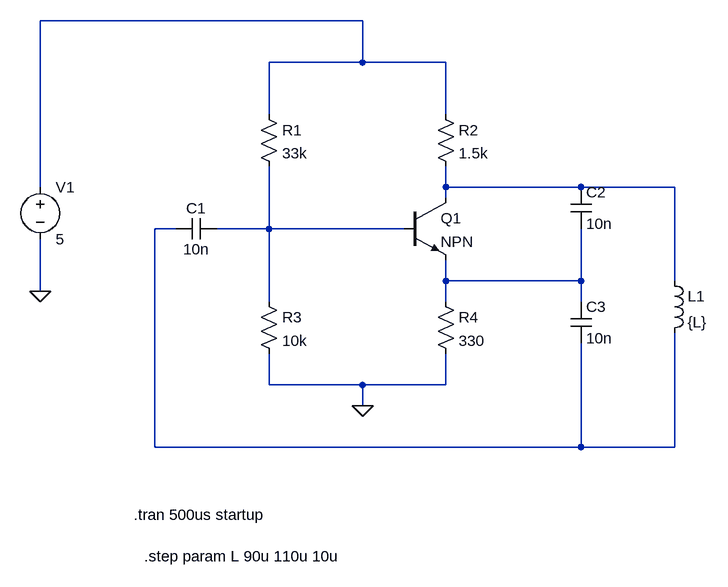
[diagram p0: schematic metal_detector_bfo.asc]
metal_detector_bfo.asc, the LTspice schematic file:
Version 4
SHEET 1 880 680
WIRE 96 -304 -400 -304
WIRE 96 -240 96 -304
WIRE 96 -240 -48 -240
WIRE 224 -240 96 -240
WIRE -48 -160 -48 -240
WIRE 224 -160 224 -240
WIRE -400 -48 -400 -304
WIRE 224 -48 224 -80
WIRE 432 -48 224 -48
WIRE 576 -48 432 -48
WIRE 224 -32 224 -48
WIRE -192 16 -224 16
WIRE -48 16 -48 -80
WIRE -48 16 -128 16
WIRE 160 16 -48 16
WIRE 224 96 224 64
WIRE 432 96 432 16
WIRE 432 96 224 96
WIRE 576 96 576 -48
WIRE -400 112 -400 32
WIRE -48 128 -48 16
WIRE 224 128 224 96
WIRE 432 128 432 96
WIRE -48 256 -48 208
WIRE 96 256 -48 256
WIRE 224 256 224 208
WIRE 224 256 96 256
WIRE 96 288 96 256
WIRE -224 352 -224 16
WIRE 432 352 432 192
WIRE 432 352 -224 352
WIRE 576 352 576 176
WIRE 576 352 432 352
FLAG 96 288 0
FLAG -400 112 0
SYMBOL res -64 -176 R0
SYMATTR InstName R1
SYMATTR Value 33k
SYMBOL res 208 -176 R0
SYMATTR InstName R2
SYMATTR Value 1.5k
SYMBOL res -64 112 R0
SYMATTR InstName R3
SYMATTR Value 10k
SYMBOL res 208 112 R0
SYMATTR InstName R4
SYMATTR Value 330
SYMBOL cap -128 0 R90
WINDOW 0 0 32 VBottom 2
WINDOW 3 32 32 VTop 2
SYMATTR InstName C1
SYMATTR Value 10n
SYMBOL cap 416 -48 R0
SYMATTR InstName C2
SYMATTR Value 10n
SYMBOL cap 416 128 R0
SYMATTR InstName C3
SYMATTR Value 10n
SYMBOL ind 560 80 R0
SYMATTR InstName L1
SYMATTR Value {L}
SYMATTR SpiceLine Rser=0.7
SYMBOL voltage -400 -64 R0
WINDOW 123 0 0 Left 2
WINDOW 39 0 0 Left 2
SYMATTR InstName V1
SYMATTR Value 5
SYMBOL npn 160 -32 R0
SYMATTR InstName Q1
TEXT -256 456 Left 2 !.tran 500us startup
TEXT -240 520 Left 2 !.step param L 90u 110u 10u

The netlist it stands for:
* metal_detector_bfo.asc
R1 N001 N004 33k
R2 N001 N002 1.5k
R3 N004 0 10k
R4 N005 0 330
C1 N004 N003 10n
C2 N002 N005 10n
C3 N005 N003 10n
L1 N002 N003 {L} Rser=0.7
V1 N001 0 5
Q1 N002 N004 N005 0 NPN
.model NPN NPN
.model PNP PNP
.lib standard.bjt
.tran 500us startup
.step param L 90u 110u 10u
.backanno
.end